# EasyEDA schematic Sheet_3.json
TITLE: Sheet_3; REV: 1.0; Date: 2023-03-08; Sheet: 1/1; Drawn By: venkatakrishnanr; Company: Your Company
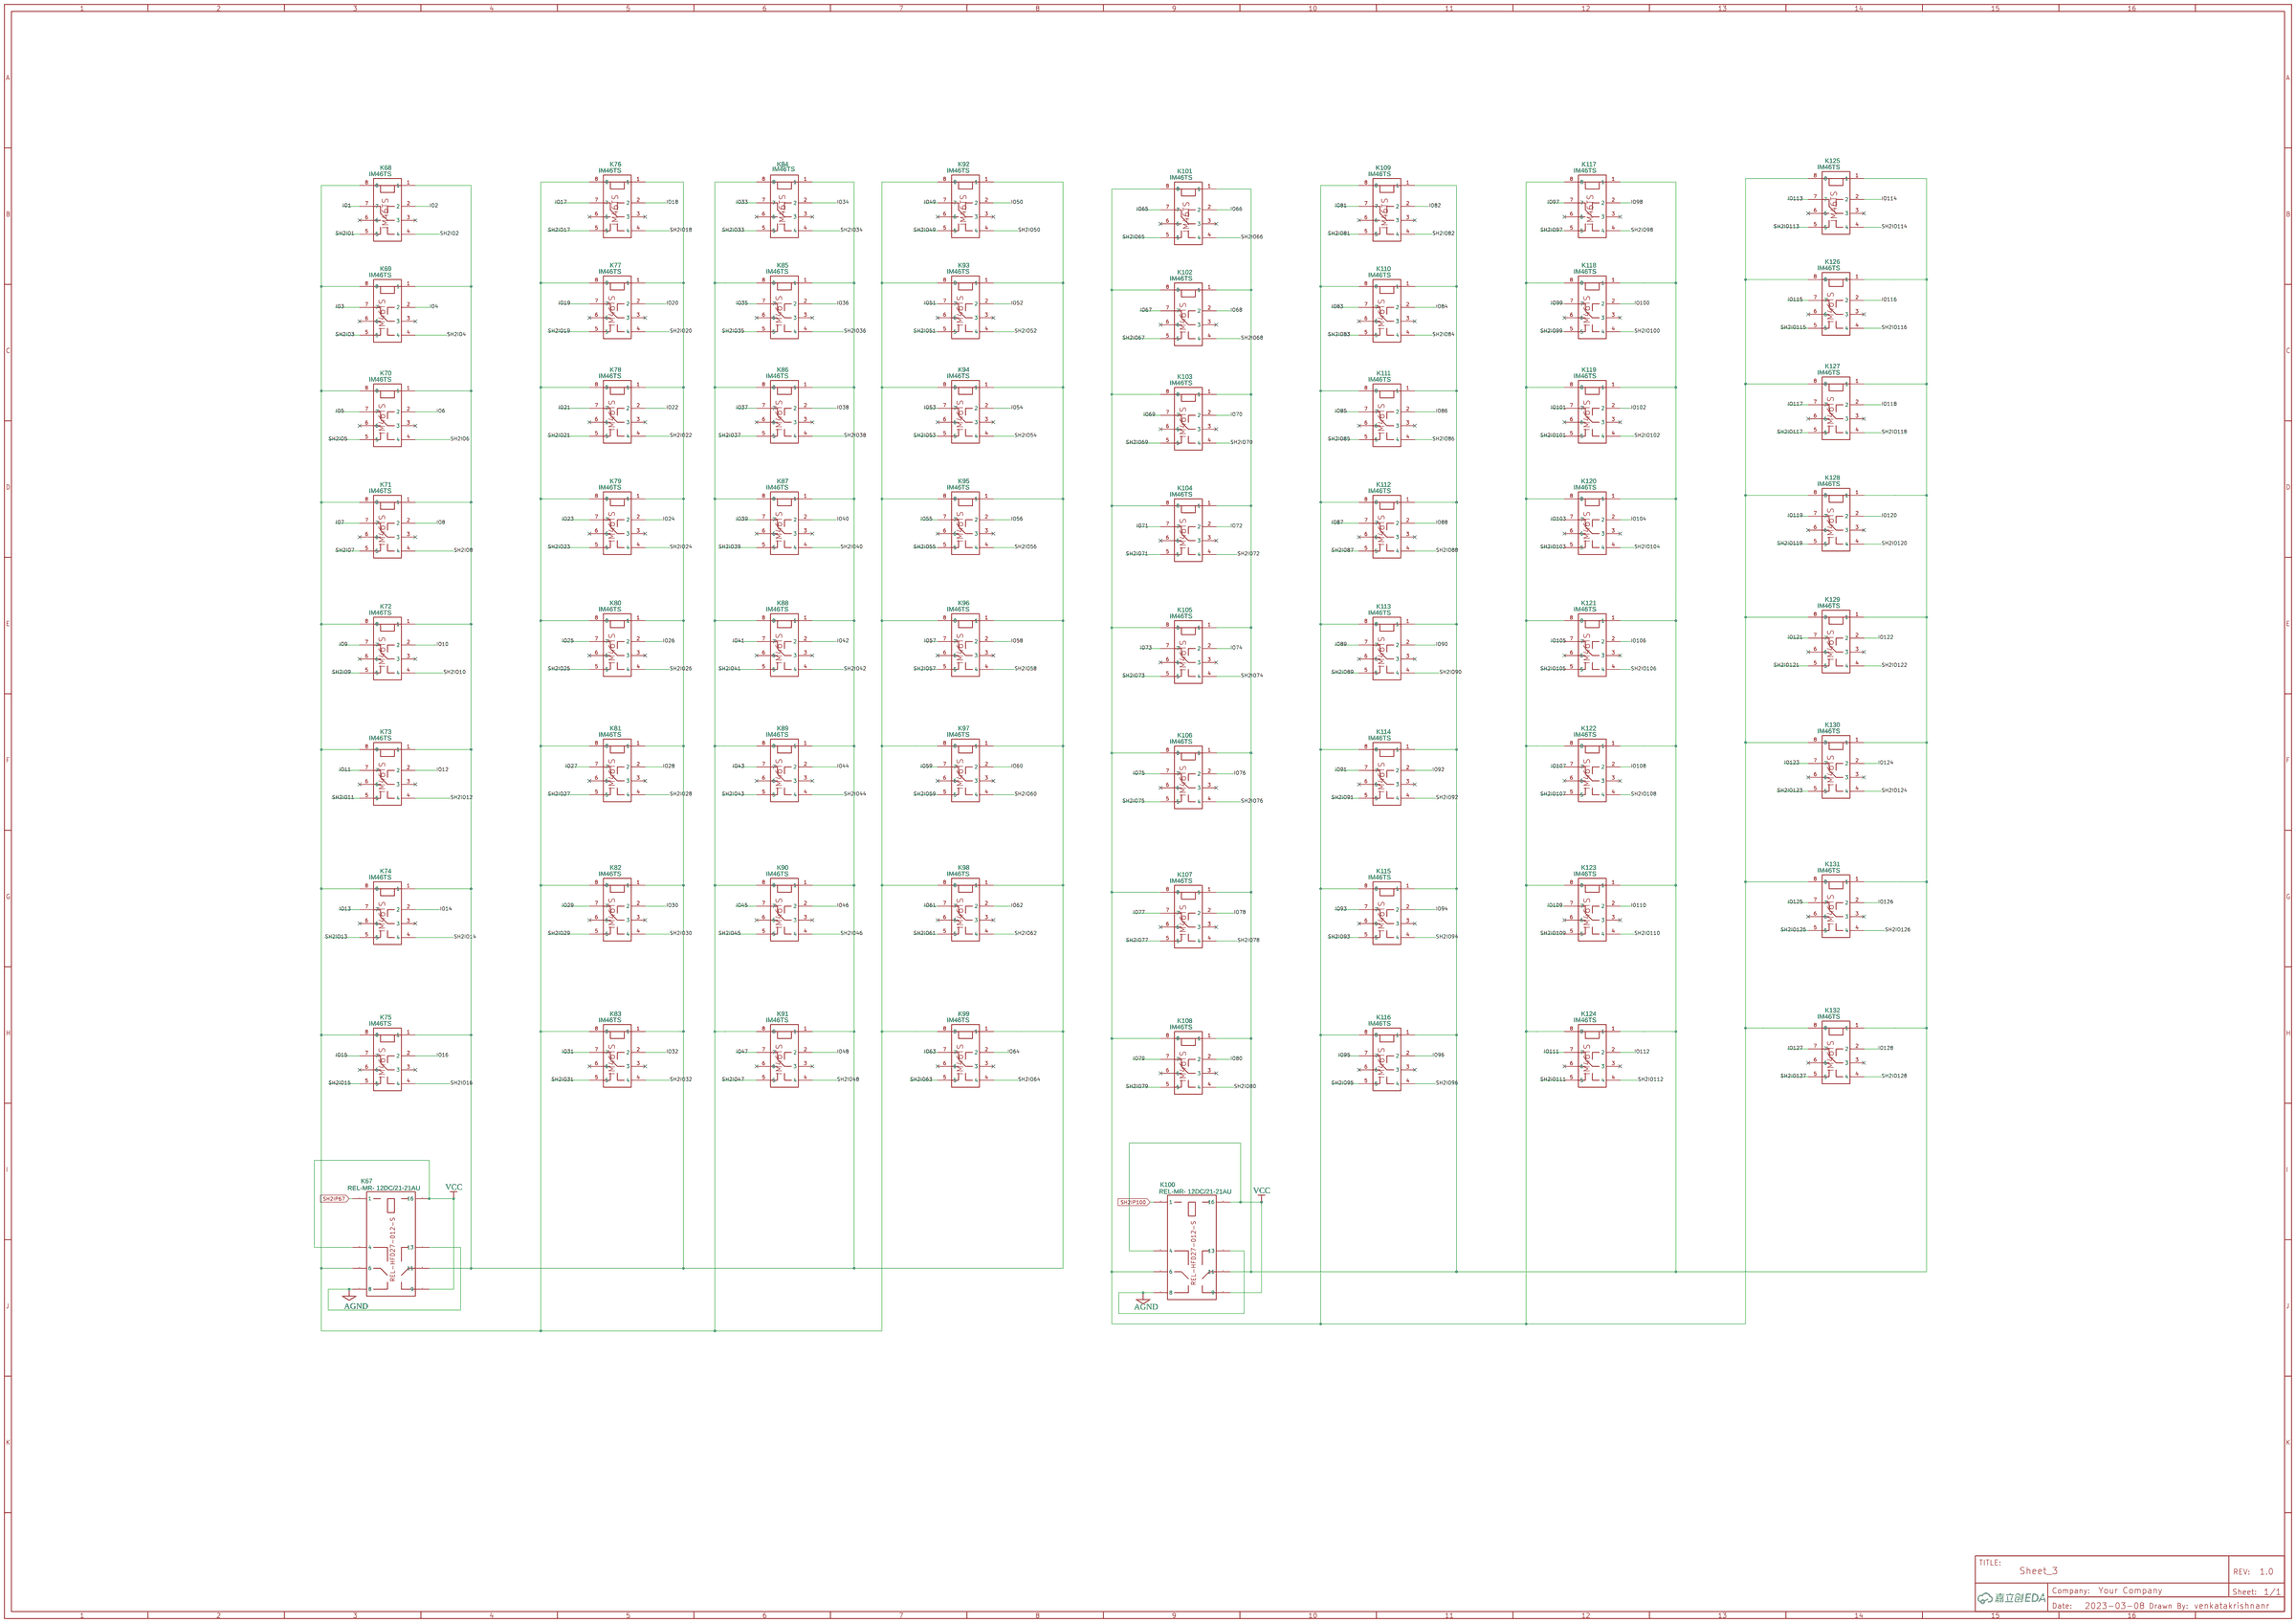
[diagram p0: schematic sheet]

## Parts
K67  REL-MR- 12DC/21-21AU  [HFD27/012-S- 12VDC]
K68  IM46TS  [SIP_01X08_D0.7MM]
K69  IM46TS  [SIP_01X08_D0.7MM]
K70  IM46TS  [SIP_01X08_D0.7MM]
K71  IM46TS  [SIP_01X08_D0.7MM]
K72  IM46TS  [SIP_01X08_D0.7MM]
K73  IM46TS  [SIP_01X08_D0.7MM]
K74  IM46TS  [SIP_01X08_D0.7MM]
K75  IM46TS  [SIP_01X08_D0.7MM]
K76  IM46TS  [SIP_01X08_D0.7MM]
K77  IM46TS  [SIP_01X08_D0.7MM]
K78  IM46TS  [SIP_01X08_D0.7MM]
K79  IM46TS  [SIP_01X08_D0.7MM]
K80  IM46TS  [SIP_01X08_D0.7MM]
K81  IM46TS  [SIP_01X08_D0.7MM]
K82  IM46TS  [SIP_01X08_D0.7MM]
K83  IM46TS  [SIP_01X08_D0.7MM]
K84  IM46TS  [SIP_01X08_D0.7MM]
K85  IM46TS  [SIP_01X08_D0.7MM]
K86  IM46TS  [SIP_01X08_D0.7MM]
K87  IM46TS  [SIP_01X08_D0.7MM]
K88  IM46TS  [SIP_01X08_D0.7MM]
K89  IM46TS  [SIP_01X08_D0.7MM]
K90  IM46TS  [SIP_01X08_D0.7MM]
K91  IM46TS  [SIP_01X08_D0.7MM]
K92  IM46TS  [SIP_01X08_D0.7MM]
K93  IM46TS  [SIP_01X08_D0.7MM]
K94  IM46TS  [SIP_01X08_D0.7MM]
K95  IM46TS  [SIP_01X08_D0.7MM]
K96  IM46TS  [SIP_01X08_D0.7MM]
K97  IM46TS  [SIP_01X08_D0.7MM]
K98  IM46TS  [SIP_01X08_D0.7MM]
K99  IM46TS  [SIP_01X08_D0.7MM]
K100  REL-MR- 12DC/21-21AU  [HFD27/012-S- 12VDC]
K101  IM46TS  [SIP_01X08_D0.7MM]
K102  IM46TS  [SIP_01X08_D0.7MM]
K103  IM46TS  [SIP_01X08_D0.7MM]
K104  IM46TS  [SIP_01X08_D0.7MM]
K105  IM46TS  [SIP_01X08_D0.7MM]
K106  IM46TS  [SIP_01X08_D0.7MM]
K107  IM46TS  [SIP_01X08_D0.7MM]
K108  IM46TS  [SIP_01X08_D0.7MM]
K109  IM46TS  [SIP_01X08_D0.7MM]
K110  IM46TS  [SIP_01X08_D0.7MM]
K111  IM46TS  [SIP_01X08_D0.7MM]
K112  IM46TS  [SIP_01X08_D0.7MM]
K113  IM46TS  [SIP_01X08_D0.7MM]
K114  IM46TS  [SIP_01X08_D0.7MM]
K115  IM46TS  [SIP_01X08_D0.7MM]
K116  IM46TS  [SIP_01X08_D0.7MM]
K117  IM46TS  [SIP_01X08_D0.7MM]
K118  IM46TS  [SIP_01X08_D0.7MM]
K119  IM46TS  [SIP_01X08_D0.7MM]
K120  IM46TS  [SIP_01X08_D0.7MM]
K121  IM46TS  [SIP_01X08_D0.7MM]
K122  IM46TS  [SIP_01X08_D0.7MM]
K123  IM46TS  [SIP_01X08_D0.7MM]
K124  IM46TS  [SIP_01X08_D0.7MM]
K125  IM46TS  [SIP_01X08_D0.7MM]
K126  IM46TS  [SIP_01X08_D0.7MM]
K127  IM46TS  [SIP_01X08_D0.7MM]
K128  IM46TS  [SIP_01X08_D0.7MM]
K129  IM46TS  [SIP_01X08_D0.7MM]
K130  IM46TS  [SIP_01X08_D0.7MM]
K131  IM46TS  [SIP_01X08_D0.7MM]
K132  IM46TS  [SIP_01X08_D0.7MM]

## Library data of the parts
K67 K100 = REL-HFD27/012-S: link: https://www.digikey.in/en/products/detail/phoenix-contact/2961299/3596906?s=N4IgTCBcDaIEoFEAyBaAsnFACAjGAIgMID0YOKZAggKogC6AvkA; Contributor: venkatakrishnanr
K68-K99 K101-K132 = IM46TS: Manufacturer: TE Connectivity Potter & Brumfield Relays; Manufacturer Part: 6-1462037-6; Supplier: Digi-Key; Supplier Part: PB2085-ND; link: https://www.digikey.in/en/products/detail/te-connectivity-potter-brumfield-relays/6-1462037-6/2398972?s=N4IgTCBcDaIJYFsAsA2ALgZxAXQL5A; Contributor: venkatakrishnanr

## Nets
AGND: K67.4(8) K67.7(13) K100.4(8) K100.7(13)
VCC: K67.2(4) K67.5(9) K67.8(16) K100.2(4) K100.5(9) K100.8(16)
IO1: K68.7
IO2: K68.2
IO3: K69.7
IO4: K69.2
IO5: K70.7
IO6: K70.2
IO7: K71.7
IO8: K71.2
IO9: K72.7
IO10: K72.2
IO11: K73.7
IO12: K73.2
IO13: K74.7
IO14: K74.2
IO15: K75.7
IO16: K75.2
IO17: K76.7
IO18: K76.2
IO19: K77.7
IO20: K77.2
IO21: K78.7
IO22: K78.2
IO23: K79.7
IO24: K79.2
IO25: K80.7
IO26: K80.2
IO27: K81.7
IO28: K81.2
IO29: K82.7
IO30: K82.2
IO31: K83.7
IO32: K83.2
IO33: K84.7
IO34: K84.2
IO35: K85.7
IO36: K85.2
IO37: K86.7
IO38: K86.2
IO39: K87.7
IO40: K87.2
IO41: K88.7
IO42: K88.2
IO43: K89.7
IO44: K89.2
IO45: K90.7
IO46: K90.2
IO47: K91.7
IO48: K91.2
IO49: K92.7
IO50: K92.2
IO51: K93.7
IO52: K93.2
IO53: K94.7
IO54: K94.2
IO55: K95.7
IO56: K95.2
IO57: K96.7
IO58: K96.2
IO59: K97.7
IO60: K97.2
IO61: K98.7
IO62: K98.2
IO63: K99.7
IO64: K99.2
IO65: K101.7
IO66: K101.2
IO67: K102.7
IO68: K102.2
IO69: K103.7
IO70: K103.2
IO71: K104.7
IO72: K104.2
IO73: K105.7
IO74: K105.2
IO75: K106.7
IO76: K106.2
IO77: K107.7
IO78: K107.2
IO79: K108.7
IO80: K108.2
IO81: K109.7
IO82: K109.2
IO83: K110.7
IO84: K110.2
IO85: K111.7
IO86: K111.2
IO87: K112.7
IO88: K112.2
IO89: K113.7
IO90: K113.2
IO91: K114.7
IO92: K114.2
IO93: K115.7
IO94: K115.2
IO95: K116.7
IO96: K116.2
IO97: K117.7
IO98: K117.2
IO99: K118.7
IO100: K118.2
IO101: K119.7
IO102: K119.2
IO103: K120.7
IO104: K120.2
IO105: K121.7
IO106: K121.2
IO107: K122.7
IO108: K122.2
IO109: K123.7
IO110: K123.2
IO111: K124.7
IO112: K124.2
IO113: K125.7
IO114: K125.2
IO115: K126.7
IO116: K126.2
IO117: K127.7
IO118: K127.2
IO119: K128.7
IO120: K128.2
IO121: K129.7
IO122: K129.2
IO123: K130.7
IO124: K130.2
IO125: K131.7
IO126: K131.2
IO127: K132.7
IO128: K132.2
SH2IO1: K68.5
SH2IO2: K68.4
SH2IO3: K69.5
SH2IO4: K69.4
SH2IO5: K70.5
SH2IO6: K70.4
SH2IO7: K71.5
SH2IO8: K71.4
SH2IO9: K72.5
SH2IO10: K72.4
SH2IO11: K73.5
SH2IO12: K73.4
SH2IO13: K74.5
SH2IO14: K74.4
SH2IO15: K75.5
SH2IO16: K75.4
SH2IO17: K76.5
SH2IO18: K76.4
SH2IO19: K77.5
SH2IO20: K77.4
SH2IO21: K78.5
SH2IO22: K78.4
SH2IO23: K79.5
SH2IO24: K79.4
SH2IO25: K80.5
SH2IO26: K80.4
SH2IO27: K81.5
SH2IO28: K81.4
SH2IO29: K82.5
SH2IO30: K82.4
SH2IO31: K83.5
SH2IO32: K83.4
SH2IO33: K84.5
SH2IO34: K84.4
SH2IO35: K85.5
SH2IO36: K85.4
SH2IO37: K86.5
SH2IO38: K86.4
SH2IO39: K87.5
SH2IO40: K87.4
SH2IO41: K88.5
SH2IO42: K88.4
SH2IO43: K89.5
SH2IO44: K89.4
SH2IO45: K90.5
SH2IO46: K90.4
SH2IO47: K91.5
SH2IO48: K91.4
SH2IO49: K92.5
SH2IO50: K92.4
SH2IO51: K93.5
SH2IO52: K93.4
SH2IO53: K94.5
SH2IO54: K94.4
SH2IO55: K95.5
SH2IO56: K95.4
SH2IO57: K96.5
SH2IO58: K96.4
SH2IO59: K97.5
SH2IO60: K97.4
SH2IO61: K98.5
SH2IO62: K98.4
SH2IO63: K99.5
SH2IO64: K99.4
SH2IO65: K101.5
SH2IO66: K101.4
SH2IO67: K102.5
SH2IO68: K102.4
SH2IO69: K103.5
SH2IO70: K103.4
SH2IO71: K104.5
SH2IO72: K104.4
SH2IO73: K105.5
SH2IO74: K105.4
SH2IO75: K106.5
SH2IO76: K106.4
SH2IO77: K107.5
SH2IO78: K107.4
SH2IO79: K108.5
SH2IO80: K108.4
SH2IO81: K109.5
SH2IO82: K109.4
SH2IO83: K110.5
SH2IO84: K110.4
SH2IO85: K111.5
SH2IO86: K111.4
SH2IO87: K112.5
SH2IO88: K112.4
SH2IO89: K113.5
SH2IO90: K113.4
SH2IO91: K114.5
SH2IO92: K114.4
SH2IO93: K115.5
SH2IO94: K115.4
SH2IO95: K116.5
SH2IO96: K116.4
SH2IO97: K117.5
SH2IO98: K117.4
SH2IO99: K118.5
SH2IO100: K118.4
SH2IO101: K119.5
SH2IO102: K119.4
SH2IO103: K120.5
SH2IO104: K120.4
SH2IO105: K121.5
SH2IO106: K121.4
SH2IO107: K122.5
SH2IO108: K122.4
SH2IO109: K123.5
SH2IO110: K123.4
SH2IO111: K124.5
SH2IO112: K124.4
SH2IO113: K125.5
SH2IO114: K125.4
SH2IO115: K126.5
SH2IO116: K126.4
SH2IO117: K127.5
SH2IO118: K127.4
SH2IO119: K128.5
SH2IO120: K128.4
SH2IO121: K129.5
SH2IO122: K129.4
SH2IO123: K130.5
SH2IO124: K130.4
SH2IO125: K131.5
SH2IO126: K131.4
SH2IO127: K132.5
SH2IO128: K132.4
SH2IP67: K67.1
SH2IP100: K100.1
Net-(K67-3): K67.3(6) K68.8 K69.8 K70.8 K71.8 K72.8 K73.8 K74.8 K75.8 K76.8 K77.8 K78.8 K79.8 K80.8 K81.8 K82.8 K83.8 K84.8 K85.8 K86.8 K87.8 K88.8 K89.8 K90.8 K91.8 K92.8 K93.8 K94.8 K95.8 K96.8 K97.8 K98.8 K99.8
Net-(K67-6): K67.6(11) K68.1 K69.1 K70.1 K71.1 K72.1 K73.1 K74.1 K75.1 K76.1 K77.1 K78.1 K79.1 K80.1 K81.1 K82.1 K83.1 K84.1 K85.1 K86.1 K87.1 K88.1 K89.1 K90.1 K91.1 K92.1 K93.1 K94.1 K95.1 K96.1 K97.1 K98.1 K99.1
Net-(K100-3): K100.3(6) K101.8 K102.8 K103.8 K104.8 K105.8 K106.8 K107.8 K108.8 K109.8 K110.8 K111.8 K112.8 K113.8 K114.8 K115.8 K116.8 K117.8 K118.8 K119.8 K120.8 K121.8 K122.8 K123.8 K124.8 K125.8 K126.8 K127.8 K128.8 K129.8 K130.8 K131.8 K132.8
Net-(K100-6): K100.6(11) K101.1 K102.1 K103.1 K104.1 K105.1 K106.1 K107.1 K108.1 K109.1 K110.1 K111.1 K112.1 K113.1 K114.1 K115.1 K116.1 K117.1 K118.1 K119.1 K120.1 K121.1 K122.1 K123.1 K124.1 K125.1 K126.1 K127.1 K128.1 K129.1 K130.1 K131.1 K132.1

Not connected (* = marked no-connect by the designer): K68 3* 6*; K69 3* 6*; K70 3* 6*; K71 3* 6*; K72 3* 6*; K73 3* 6*; K74 3* 6*; K75 3* 6*; K76 3* 6*; K77 3* 6*; K78 3* 6*; K79 3* 6*; K80 3* 6*; K81 3* 6*; K82 3* 6*; K83 3* 6*; K84 3* 6*; K85 3* 6*; K86 3* 6*; K87 3* 6*; K88 3* 6*; K89 3* 6*; K90 3* 6*; K91 3* 6*; K92 3* 6*; K93 3* 6*; K94 3* 6*; K95 3* 6*; K96 3* 6*; K97 3* 6*; K98 3* 6*; K99 3* 6*; K101 3* 6*; K102 3* 6*; K103 3* 6*; K104 3* 6*; K105 3* 6*; K106 3* 6*; K107 3* 6*; K108 3* 6*; K109 3* 6*; K110 3* 6*; K111 3* 6*; K112 3* 6*; K113 3* 6*; K114 3* 6*; K115 3* 6*; K116 3* 6*; K117 3* 6*; K118 3* 6*; K119 3* 6*; K120 3* 6*; K121 3* 6*; K122 3* 6*; K123 3* 6*; K124 3* 6*; K125 3* 6*; K126 3* 6*; K127 3* 6*; K128 3* 6*; K129 3* 6*; K130 3* 6*; K131 3* 6*; K132 3* 6*
